# EAGLE design bat-ic-hackon (EAGLE 9.6.2)
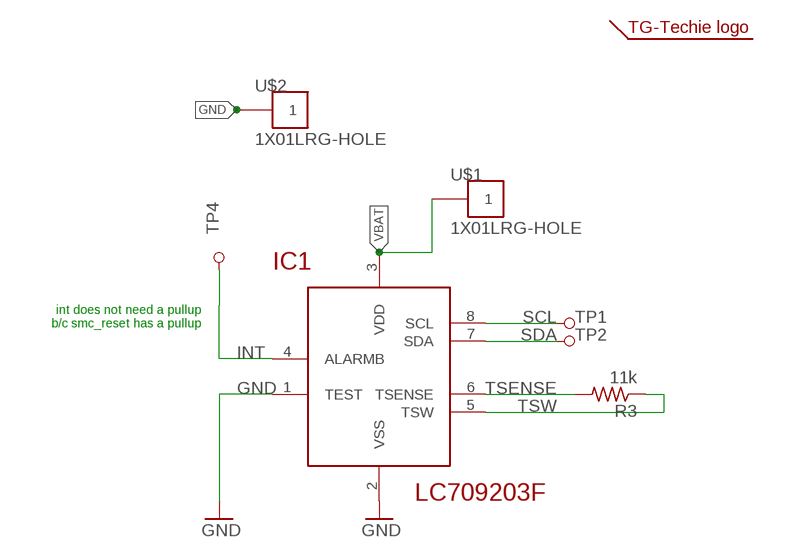
[diagram p0: schematic, sheet 1]

## Parts
IC1  LC709203F  [WDFN8_3X4_0.65]
R3  11k  R_TG_0402  [TG_0402]
TP1  TESTPOINT_1X1_SMALL  [1X1_POGO_SMALL]
TP2  TESTPOINT_1X1_SMALL  [1X1_POGO_SMALL]
TP4  TESTPOINT_1X1_SMALL  [1X1_POGO_SMALL]
U$1  1X01LRG-HOLE  [1X1_HOLE_LRG]
U$2  1X01LRG-HOLE  [1X1_HOLE_LRG]
U$3  LOGO-TG-TECHIE5MM-SYMB  [TG-LOGO-5MM-SYMB]

## Nets
GND [highpower]: IC1.1(TEST) IC1.2(VSS) U$2.1
INT: IC1.4(ALARMB) TP4.1
SCL: IC1.8(SCL) TP1.1
SDA: IC1.7(SDA) TP2.1
TSENSE: IC1.6(TSENSE) R3.2
TSW: IC1.5(TSW) R3.1
VBAT: IC1.3(VDD) U$1.1

## Notes on the sheet
- int does not need a pullup
  b/c smc_reset has a pullup

## Library data of the parts
IC1 = microbuilder:LC709203F
R3 = 0TG-Lib v01.5:R_TG
TP1 TP2 TP4 = 0TG-Lib v01.5:TESTPOINT_1X1
U$1 U$2 = 0TG-Lib v01.5:1X01
U$3 = 0TG-Lib v01.5:LOGO-TG-TECHIE

## Net classes
1 highpower: width 0.406 mm, drill 0.483 mm
2 lowpower: width 0.305 mm, drill 0.483 mm

## Board
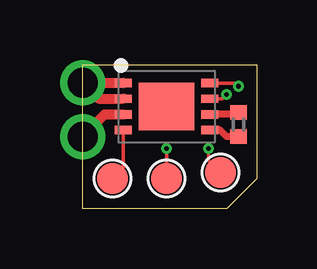
[diagram p1: board, top side]
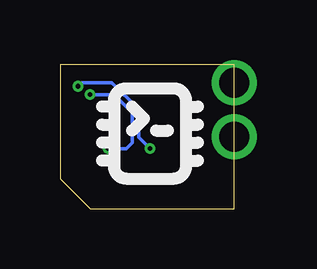
[diagram p2: board, bottom side, seen from below]

Size 7.25 x 6 mm. Coordinates in mm from the lower left corner, seen from the top.
Outline: 0,0 0,6 7.25,6 7.25,1.25 6,0 0,0
Copper layers (1*16): Top 0.035mm / dielectric 0.53mm / Bottom 0.035mm
Design rules "board-rules": minimum track width 5mil, minimum drill 0.2mm, track to track 5mil, track to pad 6mil, pad to pad 6mil, via to via 6mil, smd to smd 6mil, copper to edge 40mil, drill to drill 6mil, minimum pad ring 10mil, minimum via ring 0.125mm, stop-mask expansion 4mil, vias tented up to drill 10000mil, thermal gap 10mil

### Footprints (pad centres in the part's own frame; a part is rotated, then mirrored left to right if it is on the bottom)
WDFN8_3X4_0.65 = smd 0.7 x 0.35: 1 -1.8,0.975; 2 -1.8,0.325; 3 -1.8,-0.325; 4 -1.8,-0.975; 5 1.8,-0.975; 6 1.8,-0.325; 7 1.8,0.325; 8 1.8,0.975 | smd 2.3 x 1.96: P$9 0,0
TG_0402 = smd 0.6 x 0.7: 1 -0.5,0; 2 0.5,0
1X1_POGO_SMALL = smd 1.27 x 1.27: 1 0,0
1X1_HOLE_LRG = drill 1.25 pad 1.75: 1 0,0

### Placement (x,y rotation side)
IC1  3.5,4.25 0 top
R3  6.5,3.5 90 top
TP1  3.5,1.25 0 top
TP2  5.75,1.5 0 top
TP4  1.25,1.25 0 top
U$1  0,3 0 top
U$2  0,5.25 0 top
U$3  3.5,3 0 bottom

### Tracks (layer width: path | path; a pad name or v marks a point on that pad's centre or on a via)
GND
  Top 0.406: IC1.1 1,5.22 | 1,5.22 0.03,5.22 U$2.1 0.68,4.58 IC1.2 | 1,5.22
INT
  Top 0.152: IC1.4 1.7,1.7 TP4.1
SCL  (via drill 0.2)
  Top 0.152: TP1.1 v3.5,2.5 | IC1.8 6.38,5.22 v6.5,5.1
  Bottom 0.152: v6.5,5.1 6.35,5.25 5.09,5.25 3.97,4.13 3.97,2.97 v3.5,2.5
SDA  (via drill 0.2)
  Top 0.127: TP2.1 5.25,2 v5.25,2.5
  Top 0.152: IC1.7 5.83,4.58 v6,4.75
  Bottom 0.152: v6,4.75 5,4.75 4.25,4 4.25,2.75 4.5,2.5 v5.25,2.5
TSENSE
  Top 0.3: R3.2 6.42,3.92 IC1.6
TSW
  Top 0.3: R3.1 6,3 5.72,3.27 IC1.5
VBAT
  Top 0.406: U$1.1 0.93,3.92 IC1.3